# Altium schematic sheet Sheet1.SchDoc
size A4; SheetNumber: 1; SheetTotal: 1
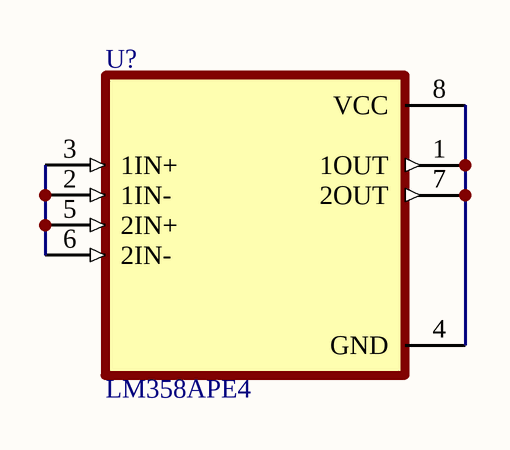
[diagram p0: Sheet1.SchDoc]

## Parts
U?  LM358APE4  [DIP794W45P254L959H508Q8]

## Nets
NetU?_1: U?.1(1OUT) U?.4(GND) U?.7(2OUT) U?.8(VCC)
NetU?_2: U?.2(1IN-) U?.3(1IN+) U?.5(2IN+) U?.6(2IN-)

## Library data of the parts
U? = LM358APE4: Dual, 30-V, 700-kHz operational amplifier; MF: Texas Instruments; Check_prices: https://www.snapeda.com/parts/LM358APE4/Texas+Instruments/view-part/?ref=eda; Value: *; Availability: In Stock; MP: LM358APE4; Price: None; Package: PDIP-8 Texas; SnapEDA_Link: https://www.snapeda.com/parts/LM358APE4/Texas+Instruments/view-part/?ref=snap; Purchase-URL: https://pricing.snapeda.com/search/part/LM358APE4/?ref=eda